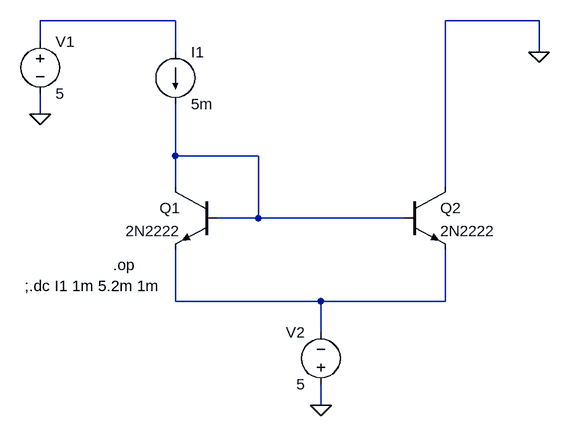
[diagram p0: schematic simple_current_mirror.asc]
simple_current_mirror.asc, the LTspice schematic file:
Version 4
SHEET 1 880 680
WIRE 160 -272 -48 -272
WIRE 720 -272 576 -272
WIRE -48 -240 -48 -272
WIRE 160 -224 160 -272
WIRE 720 -224 720 -272
WIRE -48 -128 -48 -160
WIRE 160 -64 160 -144
WIRE 288 -64 160 -64
WIRE 160 -16 160 -64
WIRE 576 -16 576 -272
WIRE 288 32 288 -64
WIRE 288 32 224 32
WIRE 512 32 288 32
WIRE 160 160 160 80
WIRE 384 160 160 160
WIRE 576 160 576 80
WIRE 576 160 384 160
WIRE 384 208 384 160
WIRE 384 320 384 288
FLAG -48 -128 0
FLAG 384 320 0
FLAG 720 -224 0
SYMBOL npn 224 -16 M0
SYMATTR InstName Q1
SYMATTR Value 2N2222
SYMBOL npn 512 -16 R0
SYMATTR InstName Q2
SYMATTR Value 2N2222
SYMBOL voltage -48 -256 R0
WINDOW 123 0 0 Left 0
WINDOW 39 0 0 Left 0
SYMATTR InstName V1
SYMATTR Value 5
SYMBOL current 160 -224 R0
WINDOW 123 0 0 Left 0
WINDOW 39 0 0 Left 0
SYMATTR InstName I1
SYMATTR Value 5m
SYMBOL voltage 384 304 R180
WINDOW 0 24 96 Left 2
WINDOW 3 24 16 Left 2
WINDOW 123 0 0 Left 0
WINDOW 39 0 0 Left 0
SYMATTR InstName V2
SYMATTR Value 5
TEXT 64 104 Left 2 !.op
TEXT -72 136 Left 2 !;.dc I1 1m 5.2m 1m

The netlist it stands for:
* simple_current_mirror.asc
Q1 N002 N002 N003 0 2N2222
Q2 0 N002 N003 0 2N2222
V1 N001 0 5
I1 N001 N002 5m
V2 0 N003 5
.model NPN NPN
.model PNP PNP
.lib standard.bjt
.op
;.dc I1 1m 5.2m 1m
.backanno
.end